# Altium project D_Project.PrjPcb (part 1 of 3)
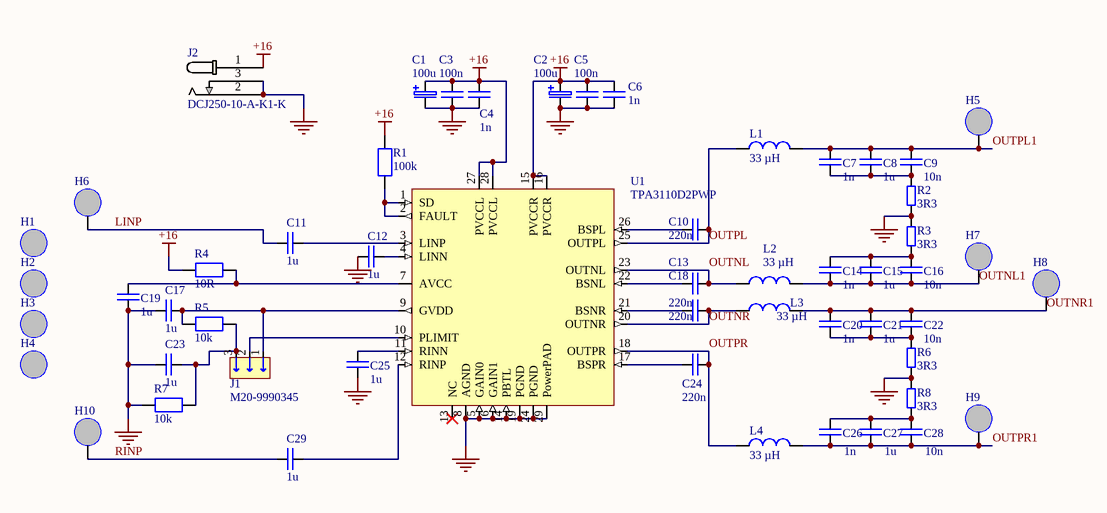
[diagram p0: D_amp_Schem.SchDoc]
1 sheet, 54 parts. Net scope: global (net labels, ports and power ports of the same name join across sheets).
Board file: D_amp_PCB.PcbDoc

## Sheet D_amp_Schem.SchDoc
size A4; SheetNumber: 1; SheetTotal: 1

### Parts
C1  100u  [Cap_100u_Alum]
C2  100u  [Cap_100u_Alum]
C3  100n  [Cap_0603]
C4  1n  [Cap_0603]
C5  100n  [Cap_0603]
C6  1n  [Cap_0603]
C7  1n  [Cap_0603]
C8  1u  [Cap_0603]
C9  10n  [Cap_0603]
C10  220n  [Cap_0603]
C11  1u  [Cap_0603]
C12  1u  [Cap_0603]
C13  220n  [Cap_0603]
C14  1n  [Cap_0603]
C15  1u  [Cap_0603]
C16  10n  [Cap_0603]
C17  1u  [Cap_0603]
C18  220n  [Cap_0603]
C19  1u  [Cap_0603]
C20  1n  [Cap_0603]
C21  1u  [Cap_0603]
C22  10n  [Cap_0603]
C23  1u  [Cap_0603]
C24  220n  [Cap_0603]
C25  1u  [Cap_0603]
C26  1n  [Cap_0603]
C27  1u  [Cap_0603]
C28  10n  [Cap_0603]
C29  1u  [Cap_0603]
H1  Mounting_Holes_3.2  [Mounting_Hole_3.2mm]  (value not drawn)
H2  Mounting_Holes_3.2  [Mounting_Hole_3.2mm]  (value not drawn)
H3  Mounting_Holes_3.2  [Mounting_Hole_3.2mm]  (value not drawn)
H4  Mounting_Holes_3.2  [Mounting_Hole_3.2mm]  (value not drawn)
H5  Mounting_Hole_Pad_2.2  [Mounting_Hole_Pad_2.2]  (value not drawn)
H6  Mounting_Hole_Pad_2.2  [Mounting_Hole_Pad_2.2]  (value not drawn)
H7  Mounting_Hole_Pad_2.2  [Mounting_Hole_Pad_2.2]  (value not drawn)
H8  Mounting_Hole_Pad_2.2  [Mounting_Hole_Pad_2.2]  (value not drawn)
H9  Mounting_Hole_Pad_2.2  [Mounting_Hole_Pad_2.2]  (value not drawn)
H10  Mounting_Hole_Pad_2.2  [Mounting_Hole_Pad_2.2]  (value not drawn)
J1  M20-9990345  [HDR1x3]
J2  DCJ250-10-A-K1-K  [DCJ250-10-A-K1-K]
L1  33 µH  [DR127-330-R]
L2  33 µH  [DR127-330-R]
L3  33 µH  [DR127-330-R]
L4  33 µH  [DR127-330-R]
R1  100k  [Res_0603]
R2  3R3  [Res_0603]
R3  3R3  [Res_0603]
R4  10R  [Res_0603]
R5  10k  [Res_0603]
R6  3R3  [Res_0603]
R7  10k  [Res_0603]
R8  3R3  [Res_0603]
U1  TPA3110D2PWP  [TPA3110D2_15_W]

### Nets
+16: C1.1 C2.1 C3.2 C4.2 C5.2 C6.2 J2.1 R1.2 R4.1 U1.15(PVCCR) U1.16(PVCCR) U1.27(PVCCL) U1.28(PVCCL)
GND: C1.2 C2.2 C3.1 C4.1 C5.1 C6.1 C12.1 C17.1 C19.1 C23.1 C25.1 J2.2 J2.3 R2.1 R3.2 R6.1 R7.1 R8.2 U1.5(GAIN0) U1.6(GAIN1) U1.8(AGND) U1.14(PBTL) U1.19(PGND) U1.24(PGND) U1.29(PowerPAD)
LINP: C11.1 H6.1
OUTNL: C13.2 L2.1 U1.23(OUTNL)
OUTNL1: C14.1 C15.1 C16.2 H7.1 L2.2
OUTNR: C18.2 L3.1 U1.20(OUTNR)
OUTNR1: C20.2 C21.2 C22.1 H8.1 L3.2
OUTPL: C10.2 L1.1 U1.25(OUTPL)
OUTPL1: C7.2 C8.2 C9.1 H5.1 L1.2
OUTPR: C24.2 L4.1 U1.18(OUTPR)
OUTPR1: C26.1 C27.1 C28.2 H9.1 L4.2
RINP: C29.1 H10.1
NetC7_1: C7.1 C8.1 C9.2 R2.2
NetC10_1: C10.1 U1.26(BSPL)
NetC11_2: C11.2 U1.3(LINP)
NetC12_2: C12.2 U1.4(LINN)
NetC13_1: C13.1 U1.22(BSNL)
NetC14_2: C14.2 C15.2 C16.1 R3.1
NetC17_2: C17.2 J1.1 R5.1 U1.9(GVDD)
NetC18_1: C18.1 U1.21(BSNR)
NetC19_2: C19.2 R4.2 U1.7(AVCC)
NetC20_1: C20.1 C21.1 C22.2 R6.2
NetC23_2: C23.2 J1.3 R5.2 R7.2
NetC24_1: C24.1 U1.17(BSPR)
NetC25_2: C25.2 U1.11(RINN)
NetC26_2: C26.2 C27.2 C28.1 R8.1
NetC29_2: C29.2 U1.12(RINP)
NetJ1_2: J1.2 U1.10(PLIMIT)
NetR1_1: R1.1 U1.1(SD) U1.2(FAULT)

Not connected (* = marked no-connect by the designer): U1 13(NC)*
### Library data of the parts
C1 C2 = Cap_100u_Alum: CAP ALUM 100UF 20% 50V SMD; Manufacturer: United Chemi-Con; Manufacturer Part Number: EMZR500ARA101MF80G; Value: 100µF; Dielectric Material: Aluminium; Dissipation Factor: 10%; ESR (Equivalent Series Resistance): 340mΩ; Lead/Base Style: Straight; Leakage Current: 50µA; Life (Hours): 2000hours; Polarity: Polar; Ripple Current: 350mA; Test Frequency: 100MHz; Supplier: DigiKey; Supplier Part Number: 565-EMZR500ARA101MF80GCT-ND; RoHS: Compliant; Category: Capacitors; Stock: 62171; Pricing: 1=0,51, 10=0,315, 50=0,233, 100=0,207 (USD); Case/Package: SMD/SMT; China RoHS: Compliant; Contact Plating: Tin Bismuth; Diameter: 6.3mm; Height: 7.7mm; Lead Free: Lead Free; Length: 7.7mm; Lifecycle Status: Production; Max Operating Temperature: 105°C; Min Operating Temperature: -55°C; Mounting Technology: Surface Mount; Pins: 2; Number of Terminals: 2; Packaging: Tape & Reel (TR); Radiation Hardening: No; REACH SVHC: No; Schedule B: 853222***; Termination: SMD/SMT; Tolerance: 20%; Voltage: 50V; Voltage Rating (DC): 50V; Width: 6.6mm; ComponentLink1URL: https://datasheet.octopart.com:443/EMZR500ARA101MF80G-Nippon-Chemicon-datasheet-182100362.pdf?src-supplier=IHS; ComponentLink1Description: https://datasheet.octopart.com:443/EMZR500ARA101MF80G-Nippon-Chemicon-datasheet-182100362.pdf?src-supplier=IHS; ComponentLink2URL: https://datasheet.octopart.com:443/EMZR500ARA101MF80G-United-Chemi-Con-datasheet-151622544.pdf?src-supplier=United+Chemi-Con; ComponentLink2Description: https://datasheet.octopart.com:443/EMZR500ARA101MF80G-United-Chemi-Con-datasheet-151622544.pdf?src-supplier=United+Chemi-Con; ComponentLink3URL: https://datasheet.octopart.com:443/EMZR500ARA101MF80G-United-Chemi-Con-datasheet-154730650.pdf?src-supplier=Electro+Sonic; ComponentLink3Description: https://datasheet.octopart.com:443/EMZR500ARA101MF80G-United-Chemi-Con-datasheet-154730650.pdf?src-supplier=Electro+Sonic
C3 C5 = Cap_100n_0603_cer: CAP CER 0.1UF 50V X7R 0603; Manufacturer: KEMET; Manufacturer Part Number: C0603C104K5RACTU; Value: 100nF; Dielectric Material: Ceramic; Dissipation Factor: 2.5%; Temperature Coefficient: 30ppm/°C; Tolerance: 10%; Supplier: Arrow Electronics; Supplier Part Number: C0603C104K5RAC7867; RoHS: Compliant; Category: Ceramic Capacitors; Stock: 11308000; Pricing: 4000=0,0127, 24000=0,0117 (USD); Case/Package: 0603; Case Code (Imperial): 0603; China RoHS: Compliant; Contact Plating: Tin; Depth: 800µm; Dielectric: X7R; Height: 800µm; Lead Free: Lead Free; Lead Pitch: 700µm; Length: 1.6mm; Lifecycle Status: Production; Material: Ceramic; Max Operating Temperature: 125°C; Min Operating Temperature: -55°C; Mounting Technology: Surface Mount; Pins: 2; Number of Terminals: 2; Packaging: Tape & Reel; Radiation Hardening: No; REACH SVHC: Yes; Schedule B: 8532240020, 8532240020|8532240020, 8532240020|8532240020|8532240020, 8532240020|8532240020|8532240020|8532240020; Termination: SMD/SMT; Thickness: 863.6µm; Voltage: 50V; Voltage Rating: 50V; Voltage Rating (DC): 50V; Width: 800µm; ComponentLink1URL: https://datasheet.octopart.com:443/C0603C104K5RACTU-KEMET-datasheet-178445679.pdf?src-supplier=IHS; ComponentLink1Description: https://datasheet.octopart.com:443/C0603C104K5RACTU-KEMET-datasheet-178445679.pdf?src-supplier=IHS; ComponentLink2URL: https://datasheet.octopart.com:443/C0603C104K5RAC7867-KEMET-datasheet-184792804.pdf?src-supplier=IHS; ComponentLink2Description: https://datasheet.octopart.com:443/C0603C104K5RAC7867-KEMET-datasheet-184792804.pdf?src-supplier=IHS; ComponentLink3URL: https://datasheet.octopart.com:443/C0603C104K5RACTU-KEMET-datasheet-137357759.pdf?src-supplier=Farnell; ComponentLink3Description: https://datasheet.octopart.com:443/C0603C104K5RACTU-KEMET-datasheet-137357759.pdf?src-supplier=Farnell; ComponentLink4URL: https://datasheet.octopart.com:443/C0603C104K5RACTU-KEMET-datasheet-149521864.pdf?src-supplier=Farnell; ComponentLink4Description: https://datasheet.octopart.com:443/C0603C104K5RACTU-KEMET-datasheet-149521864.pdf?src-supplier=Farnell; ComponentLink5URL: https://datasheet.octopart.com:443/C0603C104K5RACTU-KEMET-datasheet-101575654.pdf?src-supplier=Farnell; ComponentLink5Description: https://datasheet.octopart.com:443/C0603C104K5RACTU-KEMET-datasheet-101575654.pdf?src-supplier=Farnell; ComponentLink6URL: https://datasheet.octopart.com:443/C0603C104K5RACTU-KEMET-datasheet-176142159.pdf?src-supplier=Farnell; ComponentLink6Description: https://datasheet.octopart.com:443/C0603C104K5RACTU-KEMET-datasheet-176142159.pdf?src-supplier=Farnell; ComponentLink7URL: https://datasheet.octopart.com:443/C0603C104K5RAC-TU-Kemet-datasheet-7833651.pdf?src-supplier=Farnell; ComponentLink7Description: https://datasheet.octopart.com:443/C0603C104K5RAC-TU-Kemet-datasheet-7833651.pdf?src-supplier=Farnell; ComponentLink8URL: https://datasheet.octopart.com:443/C0603C104K5RAC-TU-Kemet-datasheet-7601896.pdf?src-supplier=Farnell; ComponentLink8Description: https://datasheet.octopart.com:443/C0603C104K5RAC-TU-Kemet-datasheet-7601896.pdf?src-supplier=Farnell; ComponentLink9URL: https://datasheet.octopart.com:443/C0603C104K5RAC-TU-Kemet-datasheet-5316294.pdf?src-supplier=Farnell; ComponentLink9Description: https://datasheet.octopart.com:443/C0603C104K5RAC-TU-Kemet-datasheet-5316294.pdf?src-supplier=Farnell; ComponentLink10URL: https://datasheet.octopart.com:443/C0603C104K5RAC-TU-Kemet-datasheet-5314837.pdf?src-supplier=Farnell; ComponentLink10Description: https://datasheet.octopart.com:443/C0603C104K5RAC-TU-Kemet-datasheet-5314837.pdf?src-supplier=Farnell; ComponentLink11URL: https://datasheet.octopart.com:443/C0603C104K5RAC-TU-Kemet-datasheet-8092359.pdf?src-supplier=Farnell; ComponentLink11Description: https://datasheet.octopart.com:443/C0603C104K5RAC-TU-Kemet-datasheet-8092359.pdf?src-supplier=Farnell; ComponentLink12URL: https://datasheet.octopart.com:443/C0603C104K5RAC-TU-Kemet-datasheet-5314449.pdf?src-supplier=Farnell; ComponentLink12Description: https://datasheet.octopart.com:443/C0603C104K5RAC-TU-Kemet-datasheet-5314449.pdf?src-supplier=Farnell; ComponentLink13URL: https://datasheet.octopart.com:443/C0603C104K5RAC-TU-Kemet-datasheet-5314969.pdf?src-supplier=Farnell; ComponentLink13Description: https://datasheet.octopart.com:443/C0603C104K5RAC-TU-Kemet-datasheet-5314969.pdf?src-supplier=Farnell; ComponentLink14URL: https://datasheet.octopart.com:443/C0603C104K5RAC-TU-Kemet-datasheet-5314627.pdf?src-supplier=Farnell; ComponentLink14Description: https://datasheet.octopart.com:443/C0603C104K5RAC-TU-Kemet-datasheet-5314627.pdf?src-supplier=Farnell; ComponentLink15URL: https://datasheet.octopart.com:443/C0603C104K5RAC-TU-Kemet-datasheet-5389132.pdf?src-supplier=Farnell; ComponentLink15Description: https://datasheet.octopart.com:443/C0603C104K5RAC-TU-Kemet-datasheet-5389132.pdf?src-supplier=Farnell; ComponentLink16URL: https://datasheet.octopart.com:443/C0603C104K5RAC-TU-Kemet-datasheet-5313836.pdf?src-supplier=Farnell; ComponentLink16Description: https://datasheet.octopart.com:443/C0603C104K5RAC-TU-Kemet-datasheet-5313836.pdf?src-supplier=Farnell; ComponentLink17URL: https://datasheet.octopart.com:443/C0603C104K5RAC-TU-Kemet-datasheet-8111010.pdf?src-supplier=Farnell; ComponentLink17Description: https://datasheet.octopart.com:443/C0603C104K5RAC-TU-Kemet-datasheet-8111010.pdf?src-supplier=Farnell; ComponentLink18URL: https://datasheet.octopart.com:443/C0603C104K5RAC-TU-Kemet-datasheet-7627733.pdf?src-supplier=Farnell; ComponentLink18Description: https://datasheet.octopart.com:443/C0603C104K5RAC-TU-Kemet-datasheet-7627733.pdf?src-supplier=Farnell; ComponentLink19URL: https://datasheet.octopart.com:443/C0603C104K5RAC-TU-Kemet-datasheet-5315946.pdf?src-supplier=Farnell; ComponentLink19Description: https://datasheet.octopart.com:443/C0603C104K5RAC-TU-Kemet-datasheet-5315946.pdf?src-supplier=Farnell; ComponentLink20URL: https://datasheet.octopart.com:443/C0603C104K5RACTU-KEMET-datasheet-137357764.pdf?src-supplier=Upverter; ComponentLink20Description: https://datasheet.octopart.com:443/C0603C104K5RACTU-KEMET-datasheet-137357764.pdf?src-supplier=Upverter; ComponentLink21URL: https://datasheet.octopart.com:443/C0603C104K5RAC-TU-Kemet-datasheet-5313890.pdf?src-supplier=Newark; ComponentLink21Description: https://datasheet.octopart.com:443/C0603C104K5RAC-TU-Kemet-datasheet-5313890.pdf?src-supplier=Newark; ComponentLink22URL: https://datasheet.octopart.com:443/C0603C104K5RACTU-Kemet-datasheet-12608295.pdf?src-supplier=Newark; ComponentLink22Description: https://datasheet.octopart.com:443/C0603C104K5RACTU-Kemet-datasheet-12608295.pdf?src-supplier=Newark; ComponentLink23URL: https://datasheet.octopart.com:443/C0603C104K5RACTU-Kemet-datasheet-11992184.pdf?src-supplier=Newark; ComponentLink23Description: https://datasheet.octopart.com:443/C0603C104K5RACTU-Kemet-datasheet-11992184.pdf?src-supplier=Newark; ComponentLink24URL: https://datasheet.octopart.com:443/C0603C104K5RACTU-Kemet-datasheet-10942409.pdf?src-supplier=Newark; ComponentLink24Description: https://datasheet.octopart.com:443/C0603C104K5RACTU-Kemet-datasheet-10942409.pdf?src-supplier=Newark; ComponentLink25URL: https://datasheet.octopart.com:443/C0603C104K5RACTU-Kemet-datasheet-10404442.pdf?src-supplier=Newark; ComponentLink25Description: https://datasheet.octopart.com:443/C0603C104K5RACTU-Kemet-datasheet-10404442.pdf?src-supplier=Newark; ComponentLink26URL: https://datasheet.octopart.com:443/C0603C104K5RAC-TU-Kemet-datasheet-5390537.pdf?src-supplier=Newark; ComponentLink26Description: https://datasheet.octopart.com:443/C0603C104K5RAC-TU-Kemet-datasheet-5390537.pdf?src-supplier=Newark; ComponentLink27URL: https://datasheet.octopart.com:443/C0603C104K5RAC-TU-Kemet-datasheet-7541751.pdf?src-supplier=Newark; ComponentLink27Description: https://datasheet.octopart.com:443/C0603C104K5RAC-TU-Kemet-datasheet-7541751.pdf?src-supplier=Newark; ComponentLink28URL: https://datasheet.octopart.com:443/C0603C104K5RACTU-KEMET-datasheet-171829795.pdf?src-supplier=Newark; ComponentLink28Description: https://datasheet.octopart.com:443/C0603C104K5RACTU-KEMET-datasheet-171829795.pdf?src-supplier=Newark; ComponentLink29URL: https://datasheet.octopart.com:443/C0603C104K5RACTU-Kemet-datasheet-8764837.pdf?src-supplier=Newark; ComponentLink29Description: https://datasheet.octopart.com:443/C0603C104K5RACTU-Kemet-datasheet-8764837.pdf?src-supplier=Newark; ComponentLink30URL: https://datasheet.octopart.com:443/C0603C104K5RACTU-Kemet-datasheet-8480123.pdf?src-supplier=Newark; ComponentLink30Description: https://datasheet.octopart.com:443/C0603C104K5RACTU-Kemet-datasheet-8480123.pdf?src-supplier=Newark; ComponentLink31URL: https://datasheet.octopart.com:443/C0603C104K5RACTU-Kemet-datasheet-5393970.pdf?src-supplier=Newark; ComponentLink31Description: https://datasheet.octopart.com:443/C0603C104K5RACTU-Kemet-datasheet-5393970.pdf?src-supplier=Newark; ComponentLink32URL: https://datasheet.octopart.com:443/C0603C104K5RACTU-Kemet-datasheet-8502025.pdf?src-supplier=Newark; ComponentLink32Description: https://datasheet.octopart.com:443/C0603C104K5RACTU-Kemet-datasheet-8502025.pdf?src-supplier=Newark; ComponentLink33URL: https://datasheet.octopart.com:443/C0603C104K5RACTU-Kemet-datasheet-161801.pdf?src-supplier=Newark; ComponentLink33Description: https://datasheet.octopart.com:443/C0603C104K5RACTU-Kemet-datasheet-161801.pdf?src-supplier=Newark; ComponentLink34URL: https://datasheet.octopart.com:443/C0603C104K5RACTU-Kemet-datasheet-32036385.pdf?src-supplier=Electro+Sonic; ComponentLink34Description: https://datasheet.octopart.com:443/C0603C104K5RACTU-Kemet-datasheet-32036385.pdf?src-supplier=Electro+Sonic; ComponentLink35URL: https://datasheet.octopart.com:443/C0603C104K5RACTU-KEMET-datasheet-157246124.pdf?src-supplier=Electro+Sonic; ComponentLink35Description: https://datasheet.octopart.com:443/C0603C104K5RACTU-KEMET-datasheet-157246124.pdf?src-supplier=Electro+Sonic; ComponentLink36URL: https://datasheet.octopart.com:443/C0603C104K5RACTU-KEMET-datasheet-164512540.pdf?src-supplier=TME; ComponentLink36Description: https://datasheet.octopart.com:443/C0603C104K5RACTU-KEMET-datasheet-164512540.pdf?src-supplier=TME; ComponentLink37URL: https://datasheet.octopart.com:443/C0603C104K5RACTU-Kemet-datasheet-67830781.pdf?src-supplier=TME; ComponentLink37Description: https://datasheet.octopart.com:443/C0603C104K5RACTU-Kemet-datasheet-67830781.pdf?src-supplier=TME; ComponentLink38URL: https://datasheet.octopart.com:443/C0603C104K5RACTU-KEMET-datasheet-68331906.pdf?src-supplier=TME; ComponentLink38Description: https://datasheet.octopart.com:443/C0603C104K5RACTU-KEMET-datasheet-68331906.pdf?src-supplier=TME; ComponentLink39URL: https://datasheet.octopart.com:443/C0603C104K5RAC7867-Kemet-datasheet-62098571.pdf?src-supplier=TME; ComponentLink39Description: https://datasheet.octopart.com:443/C0603C104K5RAC7867-Kemet-datasheet-62098571.pdf?src-supplier=TME; ComponentLink40URL: https://datasheet.octopart.com:443/C0603C104K5RAC7867-Kemet-datasheet-17577222.pdf?src-supplier=TME; ComponentLink40Description: https://datasheet.octopart.com:443/C0603C104K5RAC7867-Kemet-datasheet-17577222.pdf?src-supplier=TME; ComponentLink41URL: https://datasheet.octopart.com:443/C0603C104K5RACTU-KEMET-datasheet-110724412.pdf?src-supplier=RS+(Formerly+Allied+Electronics); ComponentLink41Description: https://datasheet.octopart.com:443/C0603C104K5RACTU-KEMET-datasheet-110724412.pdf?src-supplier=RS+(Formerly+Allied+Electronics); ComponentLink42URL: https://datasheet.octopart.com:443/C0603C104K5RACTU-Kemet-datasheet-464.pdf?src-supplier=RS+(Formerly+Allied+Electronics); ComponentLink42Description: https://datasheet.octopart.com:443/C0603C104K5RACTU-Kemet-datasheet-464.pdf?src-supplier=RS+(Formerly+Allied+Electronics); ComponentLink43URL: https://datasheet.octopart.com/C0603C104K5RACTU-KEMET-datasheet-84169754.pdf; ComponentLink43Description: https://datasheet.octopart.com/C0603C104K5RACTU-KEMET-datasheet-84169754.pdf; ComponentLink44URL: https://datasheet.octopart.com:443/C0603C104K5RACTU-Kemet-datasheet-24570007.pdf?src-supplier=element14+APAC; ComponentLink44Description: https://datasheet.octopart.com:443/C0603C104K5RACTU-Kemet-datasheet-24570007.pdf?src-supplier=element14+APAC; ComponentLink45URL: https://datasheet.octopart.com:443/C0603C104K5RACTU-Kemet-datasheet-22084244.pdf?src-supplier=element14+APAC; ComponentLink45Description: https://datasheet.octopart.com:443/C0603C104K5RACTU-Kemet-datasheet-22084244.pdf?src-supplier=element14+APAC; ComponentLink46URL: https://datasheet.octopart.com:443/C0603C104K5RACTU-Kemet-datasheet-21389238.pdf?src-supplier=element14+APAC; ComponentLink46Description: https://datasheet.octopart.com:443/C0603C104K5RACTU-Kemet-datasheet-21389238.pdf?src-supplier=element14+APAC; ComponentLink47URL: https://datasheet.octopart.com:443/C0603C104K5RACTU-Kemet-datasheet-11723057.pdf?src-supplier=Arrow+Electronics; ComponentLink47Description: https://datasheet.octopart.com:443/C0603C104K5RACTU-Kemet-datasheet-11723057.pdf?src-supplier=Arrow+Electronics; ComponentLink48URL: https://datasheet.octopart.com:443/C0603C104K5RAC7867-KEMET-datasheet-164857143.pdf?src-supplier=Burklin+Elektronik; ComponentLink48Description: https://datasheet.octopart.com:443/C0603C104K5RAC7867-KEMET-datasheet-164857143.pdf?src-supplier=Burklin+Elektronik; ComponentLink49URL: https://datasheet.octopart.com:443/C0603C104K5RAC-TU-Kemet-datasheet-8187850.pdf?src-supplier=Jameco; ComponentLink49Description: https://datasheet.octopart.com:443/C0603C104K5RAC-TU-Kemet-datasheet-8187850.pdf?src-supplier=Jameco; ComponentLink50URL: https://datasheet.octopart.com:443/C0603C104K5RACTU-Kemet-datasheet-122295.pdf?src-supplier=DigiKey; ComponentLink50Description: https://datasheet.octopart.com:443/C0603C104K5RACTU-Kemet-datasheet-122295.pdf?src-supplier=DigiKey
C4 C6 C7 C14 C20 C26 = CAP_1n_0603: CAP CER 1000PF 50V X7R 0603; Manufacturer: KEMET; Manufacturer Part Number: C0603C102K5RACTU; Value: 1nF; Dielectric Material: Ceramic; Dissipation Factor: 2.5%; Temperature Coefficient: 30ppm/°C; Tolerance: 10%; Supplier: Arrow Electronics; Supplier Part Number: C0603C102K5RAC7867; RoHS: Compliant; Category: Ceramic Capacitors; Stock: 1396000; Pricing: 4000=0,0084 (USD); Case/Package: 0603; Case Code (Imperial): 0603; China RoHS: Compliant; Contact Plating: Tin; Depth: 800µm; Dielectric: X7R; Height: 800µm; Lead Free: Lead Free; Lead Pitch: 700µm; Length: 1.6mm; Lifecycle Status: Production; Material: Ceramic; Max Operating Temperature: 125°C; Min Operating Temperature: -55°C; Mounting Technology: Surface Mount; Pins: 2; Number of Terminals: 2; Packaging: Cut Tape; Radiation Hardening: No; REACH SVHC: Yes; Schedule B: 8532240020, 8532240020|8532240020, 8532240020|8532240020|8532240020, 8532240020|8532240020|8532240020|8532240020; Termination: SMD/SMT; Thickness: 863.6µm; Voltage: 50V; Voltage Rating: 50V; Voltage Rating (AC): 50V; Voltage Rating (DC): 50V; Width: 800µm; ComponentLink1URL: https://datasheet.octopart.com:443/C0603C102K5RAC7867-KEMET-datasheet-179096092.pdf?src-supplier=IHS; ComponentLink1Description: https://datasheet.octopart.com:443/C0603C102K5RAC7867-KEMET-datasheet-179096092.pdf?src-supplier=IHS; ComponentLink2URL: https://datasheet.octopart.com:443/C0603C102K5RACTU-KEMET-datasheet-178445679.pdf?src-supplier=IHS; ComponentLink2Description: https://datasheet.octopart.com:443/C0603C102K5RACTU-KEMET-datasheet-178445679.pdf?src-supplier=IHS; ComponentLink3URL: https://datasheet.octopart.com:443/C0603C102K5RACTU-KEMET-datasheet-137357759.pdf?src-supplier=Farnell; ComponentLink3Description: https://datasheet.octopart.com:443/C0603C102K5RACTU-KEMET-datasheet-137357759.pdf?src-supplier=Farnell; ComponentLink4URL: https://datasheet.octopart.com:443/C0603C102K5RAC-TU-Kemet-datasheet-5313890.pdf?src-supplier=Farnell; ComponentLink4Description: https://datasheet.octopart.com:443/C0603C102K5RAC-TU-Kemet-datasheet-5313890.pdf?src-supplier=Farnell; ComponentLink5URL: https://datasheet.octopart.com:443/C0603C102K5RACTU-Kemet-datasheet-8764837.pdf?src-supplier=Farnell; ComponentLink5Description: https://datasheet.octopart.com:443/C0603C102K5RACTU-Kemet-datasheet-8764837.pdf?src-supplier=Farnell; ComponentLink6URL: https://datasheet.octopart.com:443/C0603C102K5RACTU-Kemet-datasheet-8480123.pdf?src-supplier=Farnell; ComponentLink6Description: https://datasheet.octopart.com:443/C0603C102K5RACTU-Kemet-datasheet-8480123.pdf?src-supplier=Farnell; ComponentLink7URL: https://datasheet.octopart.com:443/C0603C102K5RAC-TU-Kemet-datasheet-5390537.pdf?src-supplier=Farnell; ComponentLink7Description: https://datasheet.octopart.com:443/C0603C102K5RAC-TU-Kemet-datasheet-5390537.pdf?src-supplier=Farnell; ComponentLink8URL: https://datasheet.octopart.com:443/C0603C102K5RACTU-Kemet-datasheet-5393970.pdf?src-supplier=Farnell; ComponentLink8Description: https://datasheet.octopart.com:443/C0603C102K5RACTU-Kemet-datasheet-5393970.pdf?src-supplier=Farnell; ComponentLink9URL: https://datasheet.octopart.com:443/C0603C102K5RACTU-Kemet-datasheet-8502025.pdf?src-supplier=Farnell; ComponentLink9Description: https://datasheet.octopart.com:443/C0603C102K5RACTU-Kemet-datasheet-8502025.pdf?src-supplier=Farnell; ComponentLink10URL: https://datasheet.octopart.com:443/C0603C102K5RAC-TU-Kemet-datasheet-7541751.pdf?src-supplier=Farnell; ComponentLink10Description: https://datasheet.octopart.com:443/C0603C102K5RAC-TU-Kemet-datasheet-7541751.pdf?src-supplier=Farnell; ComponentLink11URL: https://datasheet.octopart.com:443/C0603C102K5RACTU-Kemet-datasheet-161801.pdf?src-supplier=Farnell; ComponentLink11Description: https://datasheet.octopart.com:443/C0603C102K5RACTU-Kemet-datasheet-161801.pdf?src-supplier=Farnell; ComponentLink12URL: https://datasheet.octopart.com:443/C0603C102K5RACTU-KEMET-datasheet-101575634.pdf?src-supplier=Farnell; ComponentLink12Description: https://datasheet.octopart.com:443/C0603C102K5RACTU-KEMET-datasheet-101575634.pdf?src-supplier=Farnell; ComponentLink13URL: https://datasheet.octopart.com:443/C0603C102K5RACTU.-Kemet-datasheet-41232427.pdf?src-supplier=Farnell; ComponentLink13Description: https://datasheet.octopart.com:443/C0603C102K5RACTU.-Kemet-datasheet-41232427.pdf?src-supplier=Farnell; ComponentLink14URL: https://datasheet.octopart.com:443/C0603C102K5RACTU-KEMET-datasheet-176142151.pdf?src-supplier=Farnell; ComponentLink14Description: https://datasheet.octopart.com:443/C0603C102K5RACTU-KEMET-datasheet-176142151.pdf?src-supplier=Farnell; ComponentLink15URL: https://datasheet.octopart.com:443/C0603C102K5RACTU-KEMET-datasheet-130256537.pdf?src-supplier=Farnell; ComponentLink15Description: https://datasheet.octopart.com:443/C0603C102K5RACTU-KEMET-datasheet-130256537.pdf?src-supplier=Farnell; ComponentLink16URL: https://datasheet.octopart.com:443/C0603C102K5RACTU-Kemet-datasheet-14356739.pdf?src-supplier=Farnell; ComponentLink16Description: https://datasheet.octopart.com:443/C0603C102K5RACTU-Kemet-datasheet-14356739.pdf?src-supplier=Farnell; ComponentLink17URL: https://datasheet.octopart.com:443/C0603C102K5RAC-TU-Kemet-datasheet-7833651.pdf?src-supplier=Farnell; ComponentLink17Description: https://datasheet.octopart.com:443/C0603C102K5RAC-TU-Kemet-datasheet-7833651.pdf?src-supplier=Farnell; ComponentLink18URL: https://datasheet.octopart.com:443/C0603C102K5RAC-TU-Kemet-datasheet-7601896.pdf?src-supplier=Farnell; ComponentLink18Description: https://datasheet.octopart.com:443/C0603C102K5RAC-TU-Kemet-datasheet-7601896.pdf?src-supplier=Farnell; ComponentLink19URL: https://datasheet.octopart.com:443/C0603C102K5RAC-TU-Kemet-datasheet-5316294.pdf?src-supplier=Farnell; ComponentLink19Description: https://datasheet.octopart.com:443/C0603C102K5RAC-TU-Kemet-datasheet-5316294.pdf?src-supplier=Farnell; ComponentLink20URL: https://datasheet.octopart.com:443/C0603C102K5RAC-TU-Kemet-datasheet-5314837.pdf?src-supplier=Farnell; ComponentLink20Description: https://datasheet.octopart.com:443/C0603C102K5RAC-TU-Kemet-datasheet-5314837.pdf?src-supplier=Farnell; ComponentLink21URL: https://datasheet.octopart.com:443/C0603C102K5RAC-TU-Kemet-datasheet-8092359.pdf?src-supplier=Farnell; ComponentLink21Description: https://datasheet.octopart.com:443/C0603C102K5RAC-TU-Kemet-datasheet-8092359.pdf?src-supplier=Farnell; ComponentLink22URL: https://datasheet.octopart.com:443/C0603C102K5RAC-TU-Kemet-datasheet-5314449.pdf?src-supplier=Farnell; ComponentLink22Description: https://datasheet.octopart.com:443/C0603C102K5RAC-TU-Kemet-datasheet-5314449.pdf?src-supplier=Farnell; ComponentLink23URL: https://datasheet.octopart.com:443/C0603C102K5RAC-TU-Kemet-datasheet-5314969.pdf?src-supplier=Farnell; ComponentLink23Description: https://datasheet.octopart.com:443/C0603C102K5RAC-TU-Kemet-datasheet-5314969.pdf?src-supplier=Farnell; ComponentLink24URL: https://datasheet.octopart.com:443/C0603C102K5RAC-TU-Kemet-datasheet-5314627.pdf?src-supplier=Farnell; ComponentLink24Description: https://datasheet.octopart.com:443/C0603C102K5RAC-TU-Kemet-datasheet-5314627.pdf?src-supplier=Farnell; ComponentLink25URL: https://datasheet.octopart.com:443/C0603C102K5RAC-TU-Kemet-datasheet-5389132.pdf?src-supplier=Farnell; ComponentLink25Description: https://datasheet.octopart.com:443/C0603C102K5RAC-TU-Kemet-datasheet-5389132.pdf?src-supplier=Farnell; ComponentLink26URL: https://datasheet.octopart.com:443/C0603C102K5RAC-TU-Kemet-datasheet-5313836.pdf?src-supplier=Farnell; ComponentLink26Description: https://datasheet.octopart.com:443/C0603C102K5RAC-TU-Kemet-datasheet-5313836.pdf?src-supplier=Farnell; ComponentLink27URL: https://datasheet.octopart.com:443/C0603C102K5RAC-TU-Kemet-datasheet-8111010.pdf?src-supplier=Farnell; ComponentLink27Description: https://datasheet.octopart.com:443/C0603C102K5RAC-TU-Kemet-datasheet-8111010.pdf?src-supplier=Farnell; ComponentLink28URL: https://datasheet.octopart.com:443/C0603C102K5RAC-TU-Kemet-datasheet-7627733.pdf?src-supplier=Farnell; ComponentLink28Description: https://datasheet.octopart.com:443/C0603C102K5RAC-TU-Kemet-datasheet-7627733.pdf?src-supplier=Farnell; ComponentLink29URL: https://datasheet.octopart.com:443/C0603C102K5RACTU-Kemet-datasheet-500041.pdf?src-supplier=Farnell; ComponentLink29Description: https://datasheet.octopart.com:443/C0603C102K5RACTU-Kemet-datasheet-500041.pdf?src-supplier=Farnell; ComponentLink30URL: https://datasheet.octopart.com:443/C0603C102K5RAC-TU-Kemet-datasheet-5315946.pdf?src-supplier=Farnell; ComponentLink30Description: https://datasheet.octopart.com:443/C0603C102K5RAC-TU-Kemet-datasheet-5315946.pdf?src-supplier=Farnell; ComponentLink31URL: https://datasheet.octopart.com:443/C0603C102K5RACTU-KEMET-datasheet-137357764.pdf?src-supplier=Upverter; ComponentLink31Description: https://datasheet.octopart.com:443/C0603C102K5RACTU-KEMET-datasheet-137357764.pdf?src-supplier=Upverter; ComponentLink32URL: https://datasheet.octopart.com:443/C0603C102K5RAC7867-KEMET-datasheet-188512054.pdf?src-supplier=ODG+(Origin+Data+Global); ComponentLink32Description: https://datasheet.octopart.com:443/C0603C102K5RAC7867-KEMET-datasheet-188512054.pdf?src-supplier=ODG+(Origin+Data+Global); ComponentLink33URL: https://datasheet.octopart.com:443/C0603C102K5RACTU-KEMET-datasheet-32036385.pdf?src-supplier=Electro+Sonic; ComponentLink33Description: https://datasheet.octopart.com:443/C0603C102K5RACTU-KEMET-datasheet-32036385.pdf?src-supplier=Electro+Sonic; ComponentLink34URL: https://datasheet.octopart.com:443/C0603C102K5RACTU-KEMET-datasheet-157246124.pdf?src-supplier=Electro+Sonic; ComponentLink34Description: https://datasheet.octopart.com:443/C0603C102K5RACTU-KEMET-datasheet-157246124.pdf?src-supplier=Electro+Sonic; ComponentLink35URL: https://datasheet.octopart.com:443/C0603C102K5RACTU-KEMET-datasheet-176142155.pdf?src-supplier=Newark; ComponentLink35Description: https://datasheet.octopart.com:443/C0603C102K5RACTU-KEMET-datasheet-176142155.pdf?src-supplier=Newark; ComponentLink36URL: https://datasheet.octopart.com:443/C0603C102K5RACTU-Kemet-datasheet-27203261.pdf?src-supplier=Newark; ComponentLink36Description: https://datasheet.octopart.com:443/C0603C102K5RACTU-Kemet-datasheet-27203261.pdf?src-supplier=Newark; ComponentLink37URL: https://datasheet.octopart.com:443/C0603C102K5RACTU-KEMET-datasheet-164512540.pdf?src-supplier=TME; ComponentLink37Description: https://datasheet.octopart.com:443/C0603C102K5RACTU-KEMET-datasheet-164512540.pdf?src-supplier=TME; ComponentLink38URL: https://datasheet.octopart.com:443/C0603C102K5RACTU-Kemet-datasheet-67830780.pdf?src-supplier=TME; ComponentLink38Description: https://datasheet.octopart.com:443/C0603C102K5RACTU-Kemet-datasheet-67830780.pdf?src-supplier=TME; ComponentLink39URL: https://datasheet.octopart.com:443/C0603C102K5RACTU-KEMET-datasheet-134791355.pdf?src-supplier=TME; ComponentLink39Description: https://datasheet.octopart.com:443/C0603C102K5RACTU-KEMET-datasheet-134791355.pdf?src-supplier=TME; ComponentLink40URL: https://datasheet.octopart.com:443/C0603C102K5RACTU-KEMET-datasheet-68331906.pdf?src-supplier=TME; ComponentLink40Description: https://datasheet.octopart.com:443/C0603C102K5RACTU-KEMET-datasheet-68331906.pdf?src-supplier=TME; ComponentLink41URL: https://datasheet.octopart.com:443/C0603C102K5RACTU-KEMET-datasheet-110724412.pdf?src-supplier=RS+(Formerly+Allied+Electronics); ComponentLink41Description: https://datasheet.octopart.com:443/C0603C102K5RACTU-KEMET-datasheet-110724412.pdf?src-supplier=RS+(Formerly+Allied+Electronics); ComponentLink42URL: https://datasheet.octopart.com:443/C0603C102K5RACTU-Kemet-datasheet-464.pdf?src-supplier=RS+(Formerly+Allied+Electronics); ComponentLink42Description: https://datasheet.octopart.com:443/C0603C102K5RACTU-Kemet-datasheet-464.pdf?src-supplier=RS+(Formerly+Allied+Electronics); ComponentLink43URL: https://datasheet.octopart.com/C0603C102K5RACTU-KEMET-datasheet-84169754.pdf; ComponentLink43Description: https://datasheet.octopart.com/C0603C102K5RACTU-KEMET-datasheet-84169754.pdf; ComponentLink44URL: https://datasheet.octopart.com:443/C0603C102K5RACTU-Kemet-datasheet-22084244.pdf?src-supplier=element14+APAC; ComponentLink44Description: https://datasheet.octopart.com:443/C0603C102K5RACTU-Kemet-datasheet-22084244.pdf?src-supplier=element14+APAC; ComponentLink45URL: https://datasheet.octopart.com:443/C0603C102K5RAC7867-KEMET-datasheet-164857143.pdf?src-supplier=Burklin+Elektronik; ComponentLink45Description: https://datasheet.octopart.com:443/C0603C102K5RAC7867-KEMET-datasheet-164857143.pdf?src-supplier=Burklin+Elektronik
C8 C11 C12 C15 C17 C19 C21 C23 C25 C27 C29 = Cap_1u_0603_cer: CAP CER 1UF 16V X7R 0603 16V; Manufacturer: KEMET; Manufacturer Part Number: C0603C105K4RACTU; Value: 1µF; Dielectric Material: Ceramic; Dissipation Factor: 3.5%; Tolerance: 10%; Supplier: Arrow Electronics; Supplier Part Number: C0603C105K4RAC7867; RoHS: Compliant; Category: Ceramic Capacitors; Stock: 5728000; Pricing: 4000=0,0208, 8000=0,0191, 12000=0,0189, 20000=0,0187, 40000=0,0186, 100000=0,0173 (USD); Case/Package: 0603; Case Code (Imperial): 0603; Case Code (Metric): 1608; China RoHS: Compliant; Contact Plating: Tin; Depth: 800µm; Dielectric: X7R; Height: 800µm; Length: 1.6mm; Lifecycle Status: Production; Material: Ceramic; Max Operating Temperature: 125°C; Min Operating Temperature: -55°C; Mounting Technology: Surface Mount; Pins: 2; Number of Terminals: 2; Packaging: Cut Tape; Radiation Hardening: No; REACH SVHC: Yes; Schedule B: 8532240020, 8532240020|8532240020|8532240020|8532240020|8532240020; Termination: SMD/SMT; Thickness: 889µm; Voltage: 16V; Voltage Rating: 16V; Voltage Rating (DC): 16V; Width: 800µm; ComponentLink1URL: https://datasheet.octopart.com:443/C0603C105K4RACTU-KEMET-datasheet-178445679.pdf?src-supplier=IHS; ComponentLink1Description: https://datasheet.octopart.com:443/C0603C105K4RACTU-KEMET-datasheet-178445679.pdf?src-supplier=IHS; ComponentLink2URL: https://datasheet.octopart.com:443/C0603C105K4RACTU-KEMET-datasheet-137357759.pdf?src-supplier=Farnell; ComponentLink2Description: https://datasheet.octopart.com:443/C0603C105K4RACTU-KEMET-datasheet-137357759.pdf?src-supplier=Farnell; ComponentLink3URL: https://datasheet.octopart.com:443/C0603C105K4RACTU-Kemet-datasheet-8764837.pdf?src-supplier=Farnell; ComponentLink3Description: https://datasheet.octopart.com:443/C0603C105K4RACTU-Kemet-datasheet-8764837.pdf?src-supplier=Farnell; ComponentLink4URL: https://datasheet.octopart.com:443/C0603C105K4RACTU-Kemet-datasheet-8480123.pdf?src-supplier=Farnell; ComponentLink4Description: https://datasheet.octopart.com:443/C0603C105K4RACTU-Kemet-datasheet-8480123.pdf?src-supplier=Farnell; ComponentLink5URL: https://datasheet.octopart.com:443/C0603C105K4RAC-TU.-Kemet-datasheet-5313890.pdf?src-supplier=Farnell; ComponentLink5Description: https://datasheet.octopart.com:443/C0603C105K4RAC-TU.-Kemet-datasheet-5313890.pdf?src-supplier=Farnell; ComponentLink6URL: https://datasheet.octopart.com:443/C0603C105K4RAC-TU-Kemet-datasheet-5390537.pdf?src-supplier=Farnell; ComponentLink6Description: https://datasheet.octopart.com:443/C0603C105K4RAC-TU-Kemet-datasheet-5390537.pdf?src-supplier=Farnell; ComponentLink7URL: https://datasheet.octopart.com:443/C0603C105K4RACTU-Kemet-datasheet-5393970.pdf?src-supplier=Farnell; ComponentLink7Description: https://datasheet.octopart.com:443/C0603C105K4RACTU-Kemet-datasheet-5393970.pdf?src-supplier=Farnell; ComponentLink8URL: https://datasheet.octopart.com:443/C0603C105K4RACTU-Kemet-datasheet-8502025.pdf?src-supplier=Farnell; ComponentLink8Description: https://datasheet.octopart.com:443/C0603C105K4RACTU-Kemet-datasheet-8502025.pdf?src-supplier=Farnell; ComponentLink9URL: https://datasheet.octopart.com:443/C0603C105K4RAC-TU-Kemet-datasheet-7541751.pdf?src-supplier=Farnell; ComponentLink9Description: https://datasheet.octopart.com:443/C0603C105K4RAC-TU-Kemet-datasheet-7541751.pdf?src-supplier=Farnell; ComponentLink10URL: https://datasheet.octopart.com:443/C0603C105K4RACTU-Kemet-datasheet-161801.pdf?src-supplier=Farnell; ComponentLink10Description: https://datasheet.octopart.com:443/C0603C105K4RACTU-Kemet-datasheet-161801.pdf?src-supplier=Farnell; ComponentLink11URL: https://datasheet.octopart.com:443/C0603C105K4RACTU-KEMET-datasheet-101575666.pdf?src-supplier=Farnell; ComponentLink11Description: https://datasheet.octopart.com:443/C0603C105K4RACTU-KEMET-datasheet-101575666.pdf?src-supplier=Farnell; ComponentLink12URL: https://datasheet.octopart.com:443/C0603C105K4RAC-TU-Kemet-datasheet-7833651.pdf?src-supplier=Farnell; ComponentLink12Description: https://datasheet.octopart.com:443/C0603C105K4RAC-TU-Kemet-datasheet-7833651.pdf?src-supplier=Farnell; ComponentLink13URL: https://datasheet.octopart.com:443/C0603C105K4RAC-TU-Kemet-datasheet-7601896.pdf?src-supplier=Farnell; ComponentLink13Description: https://datasheet.octopart.com:443/C0603C105K4RAC-TU-Kemet-datasheet-7601896.pdf?src-supplier=Farnell; ComponentLink14URL: https://datasheet.octopart.com:443/C0603C105K4RAC-TU-Kemet-datasheet-5316294.pdf?src-supplier=Farnell; ComponentLink14Description: https://datasheet.octopart.com:443/C0603C105K4RAC-TU-Kemet-datasheet-5316294.pdf?src-supplier=Farnell; ComponentLink15URL: https://datasheet.octopart.com:443/C0603C105K4RAC-TU-Kemet-datasheet-5314837.pdf?src-supplier=Farnell; ComponentLink15Description: https://datasheet.octopart.com:443/C0603C105K4RAC-TU-Kemet-datasheet-5314837.pdf?src-supplier=Farnell; ComponentLink16URL: https://datasheet.octopart.com:443/C0603C105K4RAC-TU-Kemet-datasheet-8092359.pdf?src-supplier=Farnell; ComponentLink16Description: https://datasheet.octopart.com:443/C0603C105K4RAC-TU-Kemet-datasheet-8092359.pdf?src-supplier=Farnell; ComponentLink17URL: https://datasheet.octopart.com:443/C0603C105K4RAC-TU-Kemet-datasheet-5314449.pdf?src-supplier=Farnell; ComponentLink17Description: https://datasheet.octopart.com:443/C0603C105K4RAC-TU-Kemet-datasheet-5314449.pdf?src-supplier=Farnell; ComponentLink18URL: https://datasheet.octopart.com:443/C0603C105K4RAC-TU-Kemet-datasheet-5314969.pdf?src-supplier=Farnell; ComponentLink18Description: https://datasheet.octopart.com:443/C0603C105K4RAC-TU-Kemet-datasheet-5314969.pdf?src-supplier=Farnell; ComponentLink19URL: https://datasheet.octopart.com:443/C0603C105K4RAC-TU-Kemet-datasheet-5314627.pdf?src-supplier=Farnell; ComponentLink19Description: https://datasheet.octopart.com:443/C0603C105K4RAC-TU-Kemet-datasheet-5314627.pdf?src-supplier=Farnell; ComponentLink20URL: https://datasheet.octopart.com:443/C0603C105K4RAC-TU-Kemet-datasheet-5389132.pdf?src-supplier=Farnell; ComponentLink20Description: https://datasheet.octopart.com:443/C0603C105K4RAC-TU-Kemet-datasheet-5389132.pdf?src-supplier=Farnell; ComponentLink21URL: https://datasheet.octopart.com:443/C0603C105K4RAC-TU-Kemet-datasheet-5313836.pdf?src-supplier=Farnell; ComponentLink21Description: https://datasheet.octopart.com:443/C0603C105K4RAC-TU-Kemet-datasheet-5313836.pdf?src-supplier=Farnell; ComponentLink22URL: https://datasheet.octopart.com:443/C0603C105K4RAC-TU-Kemet-datasheet-8111010.pdf?src-supplier=Farnell; ComponentLink22Description: https://datasheet.octopart.com:443/C0603C105K4RAC-TU-Kemet-datasheet-8111010.pdf?src-supplier=Farnell; ComponentLink23URL: https://datasheet.octopart.com:443/C0603C105K4RAC-TU-Kemet-datasheet-7627733.pdf?src-supplier=Farnell; ComponentLink23Description: https://datasheet.octopart.com:443/C0603C105K4RAC-TU-Kemet-datasheet-7627733.pdf?src-supplier=Farnell; ComponentLink24URL: https://datasheet.octopart.com:443/C0603C105K4RAC-TU-Kemet-datasheet-5315946.pdf?src-supplier=Farnell; ComponentLink24Description: https://datasheet.octopart.com:443/C0603C105K4RAC-TU-Kemet-datasheet-5315946.pdf?src-supplier=Farnell; ComponentLink25URL: https://datasheet.octopart.com:443/C0603C105K4RAC7867-KEMET-datasheet-188512054.pdf?src-supplier=ODG+(Origin+Data+Global); ComponentLink25Description: https://datasheet.octopart.com:443/C0603C105K4RAC7867-KEMET-datasheet-188512054.pdf?src-supplier=ODG+(Origin+Data+Global); ComponentLink26URL: https://datasheet.octopart.com:443/C0603C105K4RACTU-KEMET-datasheet-157246124.pdf?src-supplier=Electro+Sonic; ComponentLink26Description: https://datasheet.octopart.com:443/C0603C105K4RACTU-KEMET-datasheet-157246124.pdf?src-supplier=Electro+Sonic; ComponentLink27URL: https://datasheet.octopart.com:443/C0603C105K4RACTU-KEMET-datasheet-32036385.pdf?src-supplier=Electro+Sonic; ComponentLink27Description: https://datasheet.octopart.com:443/C0603C105K4RACTU-KEMET-datasheet-32036385.pdf?src-supplier=Electro+Sonic; ComponentLink28URL: https://datasheet.octopart.com:443/C0603C105K4RACTU-Kemet-datasheet-22084244.pdf?src-supplier=Newark; ComponentLink28Description: https://datasheet.octopart.com:443/C0603C105K4RACTU-Kemet-datasheet-22084244.pdf?src-supplier=Newark; ComponentLink29URL: https://datasheet.octopart.com:443/C0603C105K4RACTU-Kemet-datasheet-12608295.pdf?src-supplier=Newark; ComponentLink29Description: https://datasheet.octopart.com:443/C0603C105K4RACTU-Kemet-datasheet-12608295.pdf?src-supplier=Newark; ComponentLink30URL: https://datasheet.octopart.com:443/C0603C105K4RACTU-Kemet-datasheet-11992184.pdf?src-supplier=Newark; ComponentLink30Description: https://datasheet.octopart.com:443/C0603C105K4RACTU-Kemet-datasheet-11992184.pdf?src-supplier=Newark; ComponentLink31URL: https://datasheet.octopart.com:443/C0603C105K4RACTU-Kemet-datasheet-10942409.pdf?src-supplier=Newark; ComponentLink31Description: https://datasheet.octopart.com:443/C0603C105K4RACTU-Kemet-datasheet-10942409.pdf?src-supplier=Newark; ComponentLink32URL: https://datasheet.octopart.com:443/C0603C105K4RACTU-Kemet-datasheet-10404442.pdf?src-supplier=Newark; ComponentLink32Description: https://datasheet.octopart.com:443/C0603C105K4RACTU-Kemet-datasheet-10404442.pdf?src-supplier=Newark; ComponentLink33URL: https://datasheet.octopart.com:443/C0603C105K4RACTU-KEMET-datasheet-164512540.pdf?src-supplier=TME; ComponentLink33Description: https://datasheet.octopart.com:443/C0603C105K4RACTU-KEMET-datasheet-164512540.pdf?src-supplier=TME; ComponentLink34URL: https://datasheet.octopart.com:443/C0603C105K4RACTU-KEMET-datasheet-68311255.pdf?src-supplier=TME; ComponentLink34Description: https://datasheet.octopart.com:443/C0603C105K4RACTU-KEMET-datasheet-68311255.pdf?src-supplier=TME; ComponentLink35URL: https://datasheet.octopart.com:443/C0603C105K4RACTU-KEMET-datasheet-68331906.pdf?src-supplier=TME; ComponentLink35Description: https://datasheet.octopart.com:443/C0603C105K4RACTU-KEMET-datasheet-68331906.pdf?src-supplier=TME; ComponentLink36URL: https://datasheet.octopart.com:443/C0603C105K4RACTU-KEMET-datasheet-110724412.pdf?src-supplier=RS+(Formerly+Allied+Electronics); ComponentLink36Description: https://datasheet.octopart.com:443/C0603C105K4RACTU-KEMET-datasheet-110724412.pdf?src-supplier=RS+(Formerly+Allied+Electronics); ComponentLink37URL: https://datasheet.octopart.com:443/C0603C105K4RACTU-Kemet-datasheet-60243841.pdf?src-supplier=RS+(Formerly+Allied+Electronics); ComponentLink37Description: https://datasheet.octopart.com:443/C0603C105K4RACTU-Kemet-datasheet-60243841.pdf?src-supplier=RS+(Formerly+Allied+Electronics); ComponentLink38URL: https://datasheet.octopart.com/C0603C105K4RACTU-KEMET-datasheet-84169754.pdf; ComponentLink38Description: https://datasheet.octopart.com/C0603C105K4RACTU-KEMET-datasheet-84169754.pdf; ComponentLink39URL: https://datasheet.octopart.com:443/C0603C105K4RACTU-Kemet-datasheet-24570007.pdf?src-supplier=element14+APAC; ComponentLink39Description: https://datasheet.octopart.com:443/C0603C105K4RACTU-Kemet-datasheet-24570007.pdf?src-supplier=element14+APAC; ComponentLink40URL: https://datasheet.octopart.com:443/C0603C105K4RACTU-Kemet-datasheet-21389240.pdf?src-supplier=element14+APAC; ComponentLink40Description: https://datasheet.octopart.com:443/C0603C105K4RACTU-Kemet-datasheet-21389240.pdf?src-supplier=element14+APAC; ComponentLink41URL: https://datasheet.octopart.com:443/C0603C105K4RACTU-Kemet-datasheet-11546808.pdf?src-supplier=Arrow+Electronics; ComponentLink41Description: https://datasheet.octopart.com:443/C0603C105K4RACTU-Kemet-datasheet-11546808.pdf?src-supplier=Arrow+Electronics; ComponentLink42URL: https://datasheet.octopart.com:443/C0603C105K4RAC7867-KEMET-datasheet-164857143.pdf?src-supplier=Burklin+Elektronik; ComponentLink42Description: https://datasheet.octopart.com:443/C0603C105K4RAC7867-KEMET-datasheet-164857143.pdf?src-supplier=Burklin+Elektronik